# EAGLE design Motor_board (EAGLE 7.1.0)
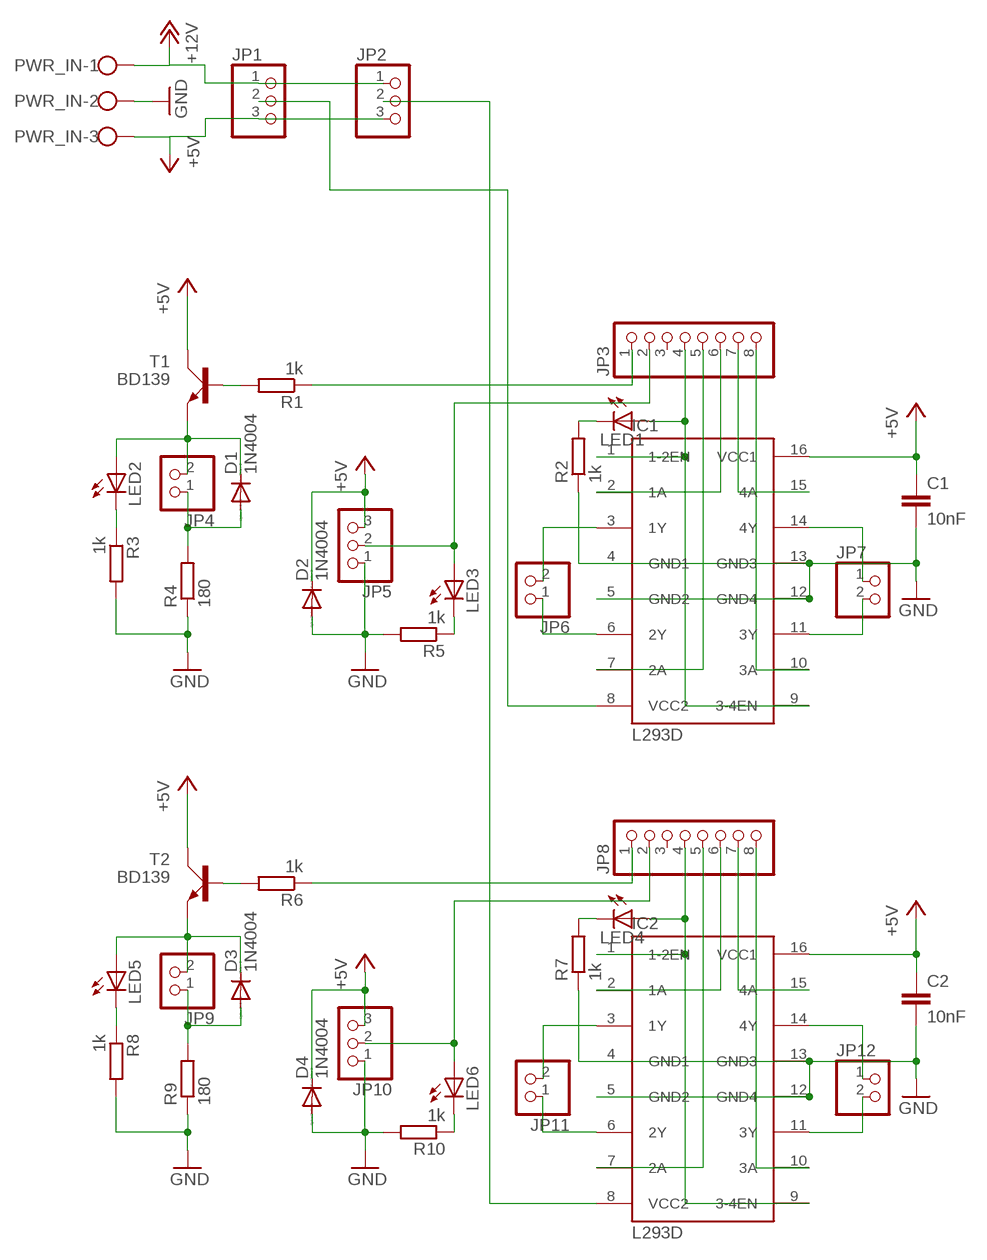
[diagram p0: schematic, sheet 1]

## Parts
C1  10nF  C-EU050-024X044  [C050-024X044]
C2  10nF  C-EU050-024X044  [C050-024X044]
D1  1N4004  [DO41-10]
D2  1N4004  [DO41-10]
D3  1N4004  [DO41-10]
D4  1N4004  [DO41-10]
IC1  L293D  [DIL16]
IC2  L293D  [DIL16]
JP1  PINHD-1X3  [1X03]
JP2  PINHD-1X3  [1X03]
JP3  PINHD-1X8  [1X08]
JP4  PINHD-1X2  [1X02]
JP5  PINHD-1X3  [1X03]
JP6  PINHD-1X2  [1X02]
JP7  PINHD-1X2  [1X02]
JP8  PINHD-1X8  [1X08]
JP9  PINHD-1X2  [1X02]
JP10  PINHD-1X3  [1X03]
JP11  PINHD-1X2  [1X02]
JP12  PINHD-1X2  [1X02]
LED1  LED3MM  [LED3MM]
LED2  LED3MM  [LED3MM]
LED3  LED3MM  [LED3MM]
LED4  LED3MM  [LED3MM]
LED5  LED3MM  [LED3MM]
LED6  LED3MM  [LED3MM]
PWR_IN  W237-103  [W237-103]
R1  1k  R-EU_0207/7  [0207/7]
R2  1k  R-EU_0207/7  [0207/7]
R3  1k  R-EU_0207/7  [0207/7]
R4  180  R-EU_0414/5V  [0414V]
R5  1k  R-EU_0207/7  [0207/7]
R6  1k  R-EU_0207/7  [0207/7]
R7  1k  R-EU_0207/7  [0207/7]
R8  1k  R-EU_0207/7  [0207/7]
R9  180  R-EU_0414/5V  [0414V]
R10  1k  R-EU_0207/7  [0207/7]
T1  BD139  [TO126AV]
T2  BD139  [TO126AV]

## Nets
+5V [power]: C1.1 C2.1 D2.C D4.C IC1.16(VCC1) IC2.16(VCC1) JP1.3 JP2.3 JP5.3 JP10.3 PWR_IN.3 T1.C T2.C
+12V [power]: JP1.1 JP2.1 PWR_IN.1
GND: C1.2 C2.2 D2.A D4.A IC1.4(GND1) IC1.5(GND2) IC1.12(GND4) IC1.13(GND3) IC2.4(GND1) IC2.5(GND2) IC2.12(GND4) IC2.13(GND3) JP5.1 JP10.1 PWR_IN.2 R2.1 R3.2 R4.1 R5.2 R7.1 R8.2 R9.1 R10.2
MTR_PWR1 [power]: IC1.8(VCC2) JP1.2
MTR_PWR2 [power]: IC2.8(VCC2) JP2.2
N$1: IC2.1(1-2EN) IC2.9(3-4EN) JP8.4 LED4.A
N$2: IC2.2(1A) JP8.6
N$3: IC2.7(2A) JP8.5
N$4: IC2.3(1Y) JP11.2
N$5: IC2.6(2Y) JP11.1
N$6: IC2.11(3Y) JP12.2
N$7: IC1.1(1-2EN) IC1.9(3-4EN) JP3.4 LED1.A
N$8: IC1.10(3A) JP3.8
N$9: IC2.14(4Y) JP12.1
N$10: IC1.2(1A) JP3.6
N$11: IC1.7(2A) JP3.5
N$12: IC1.15(4A) JP3.7
N$13: IC2.10(3A) JP8.8
N$14: IC1.3(1Y) JP6.2
N$15: IC1.6(2Y) JP6.1
N$16: IC1.11(3Y) JP7.2
N$17: IC1.14(4Y) JP7.1
N$18: IC2.15(4A) JP8.7
N$19: R6.2 T2.B
N$20: JP8.1 R6.1
N$21: JP8.2 JP10.2 LED6.A
N$22: D3.A JP9.1 R9.2
N$23: LED1.K(C) R2.2
N$24: R1.2 T1.B
N$25: JP3.1 R1.1
N$26: D1.A JP4.1 R4.2
N$27: JP3.2 JP5.2 LED3.A
N$28: D3.C JP9.2 LED5.A T2.E
N$29: LED5.K(C) R8.1
N$30: LED4.K(C) R7.2
N$31: LED6.K(C) R10.1
N$32: D1.C JP4.2 LED2.A T1.E
N$33: LED2.K(C) R3.1
N$35: LED3.K(C) R5.1
Unconnected: JP3.3 JP8.3

## Library data of the parts
C1 C2 = rcl:C-EU: CAPACITOR, European symbol
D1-D4 = diode:1N4004: DIODE general purpose rectifier, 1 A
IC1 IC2 = st-microelectronics:L293D: PUSH-PULL 4 CHANNEL DRIVER; MPN: L293D; OC_FARNELL: 9589619; OC_NEWARK: 56P8249
JP1 JP2 JP5 JP10 = pinhead:PINHD-1X3: PIN HEADER
JP3 JP8 = pinhead:PINHD-1X8: PIN HEADER
JP4 JP6 JP7 JP9 JP11 JP12 = pinhead:PINHD-1X2: PIN HEADER
LED1-LED6 = led:LED: LED OSRAM: - CHIPLED LG R971, LG N971, LY N971, LG Q971, LY Q971, LO R971, LY R971 LH N974, LH R974 LS Q976, LO Q976, LY Q976 LO Q996 - Hyper CHIPLED LW Q18S LB Q993, LB Q99A, LB R99A - SideLED LS A670, LO A670, LY A670, LG A670, LP A670 LB A673, LV A673, LT A673, LW A673 LH A674 LY A675 LS A676, LA A676, LO A676, LY A676, LW A676 LS A679, LY A679, LG A679 - Hyper Micro SIDELED® LS Y876, LA Y876, LO Y876, LY Y876 LT Y87S - SmartLED LW L88C, LW L88S LB L89C, LB L89S, LG L890 LS L89K, LO L89K, LY L89K LS L896, LA L896, LO L896, LY L896 - TOPLED LS T670, LO T670, LY T670, LG T670, LP T670 LSG T670, LSP T670, LSY T670, LOP T670, LYG T670 LG T671, LOG T671, LSG T671 LB T673, LV T673, LT T673, LW T673 LH T674 LS T676, LA T676, LO T676, LY T676, LB T676, LH T676, LSB T676, LW T676 LB T67C, LV T67C, LT T67C, LS T67K, LO T67K, LY T67K, LW E67C LS E67B, LA E67B, LO E67B, LY E67B, LB E67C, LV E67C, LT E67C LW T67C LS T679, LY T679, LG T679 LS T770, LO T770, LY T770, LG T770, LP T770 LB T773, LV T773, LT T773, LW T773 LH T774 LS E675, LA E675, LY E675, LS T675 LS T776, LA T776, LO T776, LY T776, LB T776 LHGB T686 LT T68C, LB T68C - Hyper Mini TOPLED® LB M676 - Mini TOPLED Santana® LG M470 LS M47K, LO M47K, LY M47K Source: http://www.osram.convergy.de LUXEON: - LUMILED® LXK2-PW12-R00, LXK2-PW12-S00, LXK2-PW14-U00, LXK2-PW14-V00 LXK2-PM12-R00, LXK2-PM12-S00, LXK2-PM14-U00 LXK2-PE12-Q00, LXK2-PE12-R00, LXK2-PE12-S00, LXK2-PE14-T00, LXK2-PE14-U00 LXK2-PB12-K00, LXK2-PB12-L00, LXK2-PB12-M00, LXK2-PB14-N00, LXK2-PB14-P00, LXK2-PB14-Q00 LXK2-PR12-L00, LXK2-PR12-M00, LXK2-PR14-Q00, LXK2-PR14-R00 LXK2-PD12-Q00, LXK2-PD12-R00, LXK2-PD12-S00 LXK2-PH12-R00, LXK2-PH12-S00 LXK2-PL12-P00, LXK2-PL12-Q00, LXK2-PL12-R00 Source: www.luxeon.com KINGBRIGHT: KA-3528ASYC Source: www.kingbright.com
PWR_IN = con-wago-500:W237-103: WAGO SCREW CLAMP; MPN: 237-103; OC_FARNELL: unknown; OC_NEWARK: 18M7116
R1-R10 = rcl:R-EU_: RESISTOR, European symbol
T1 T2 = transistor-power:BD139: NPN TRANSISTOR

## Net classes
1 power: width 0.4 mm

## Board
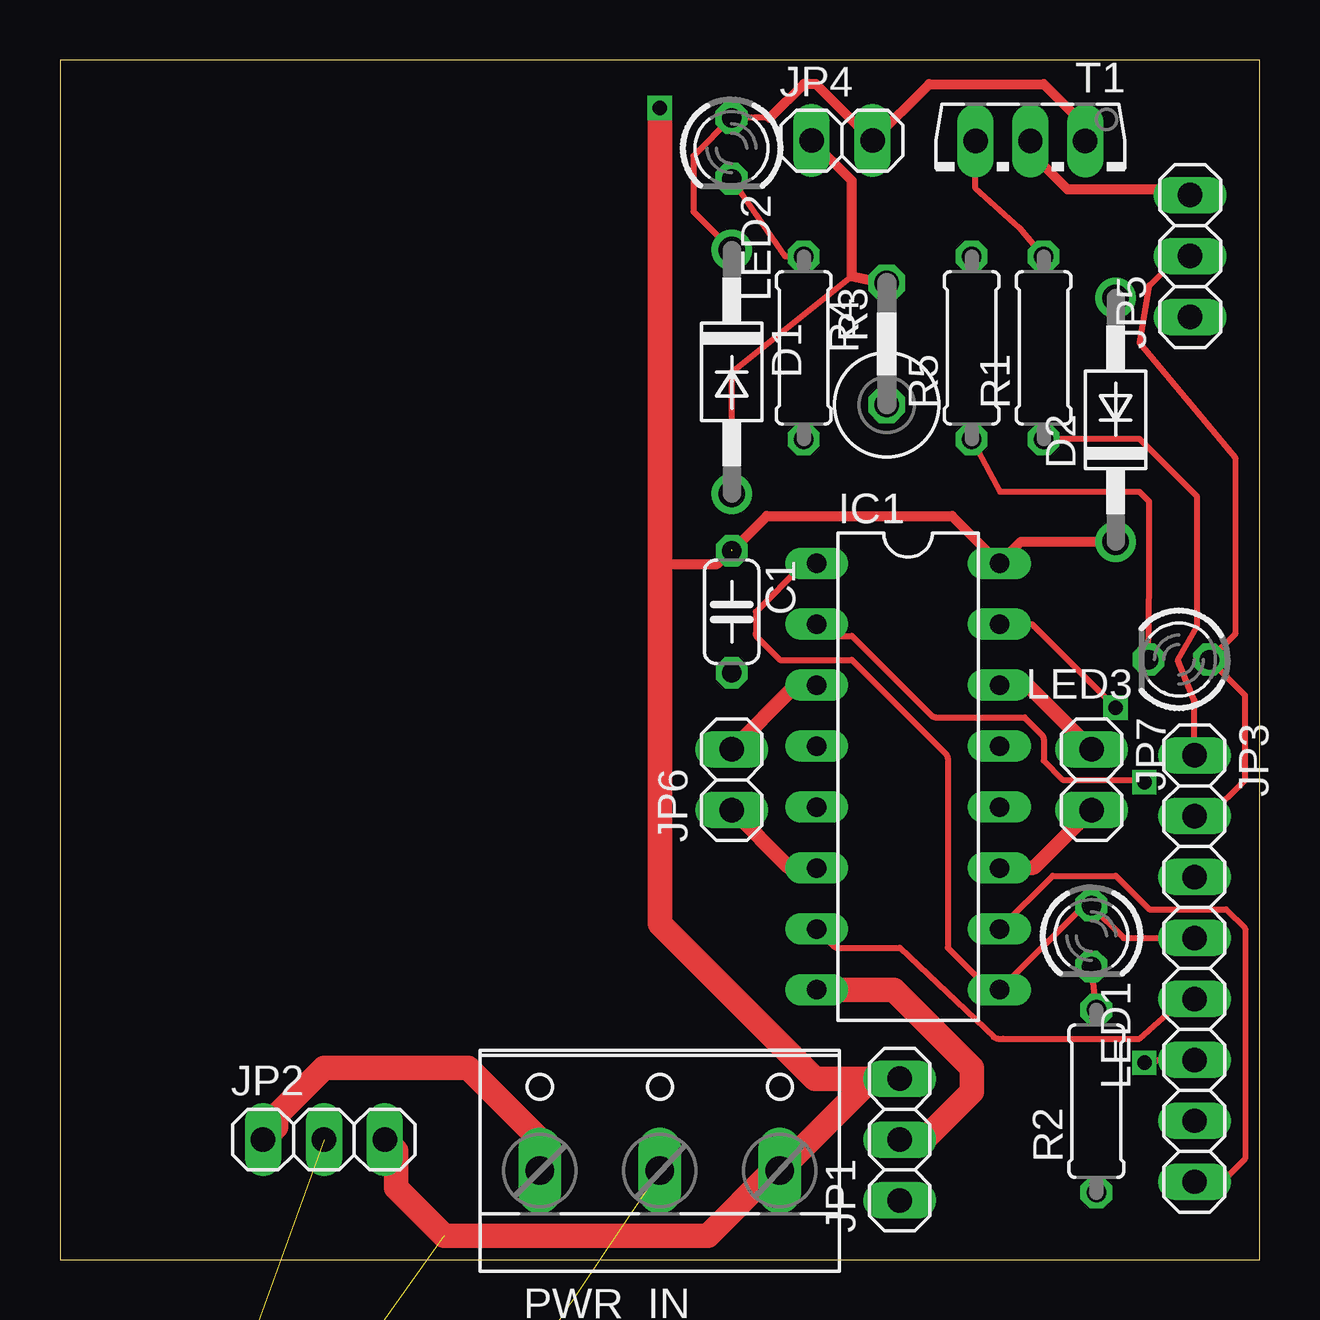
[diagram p1: board, top side]
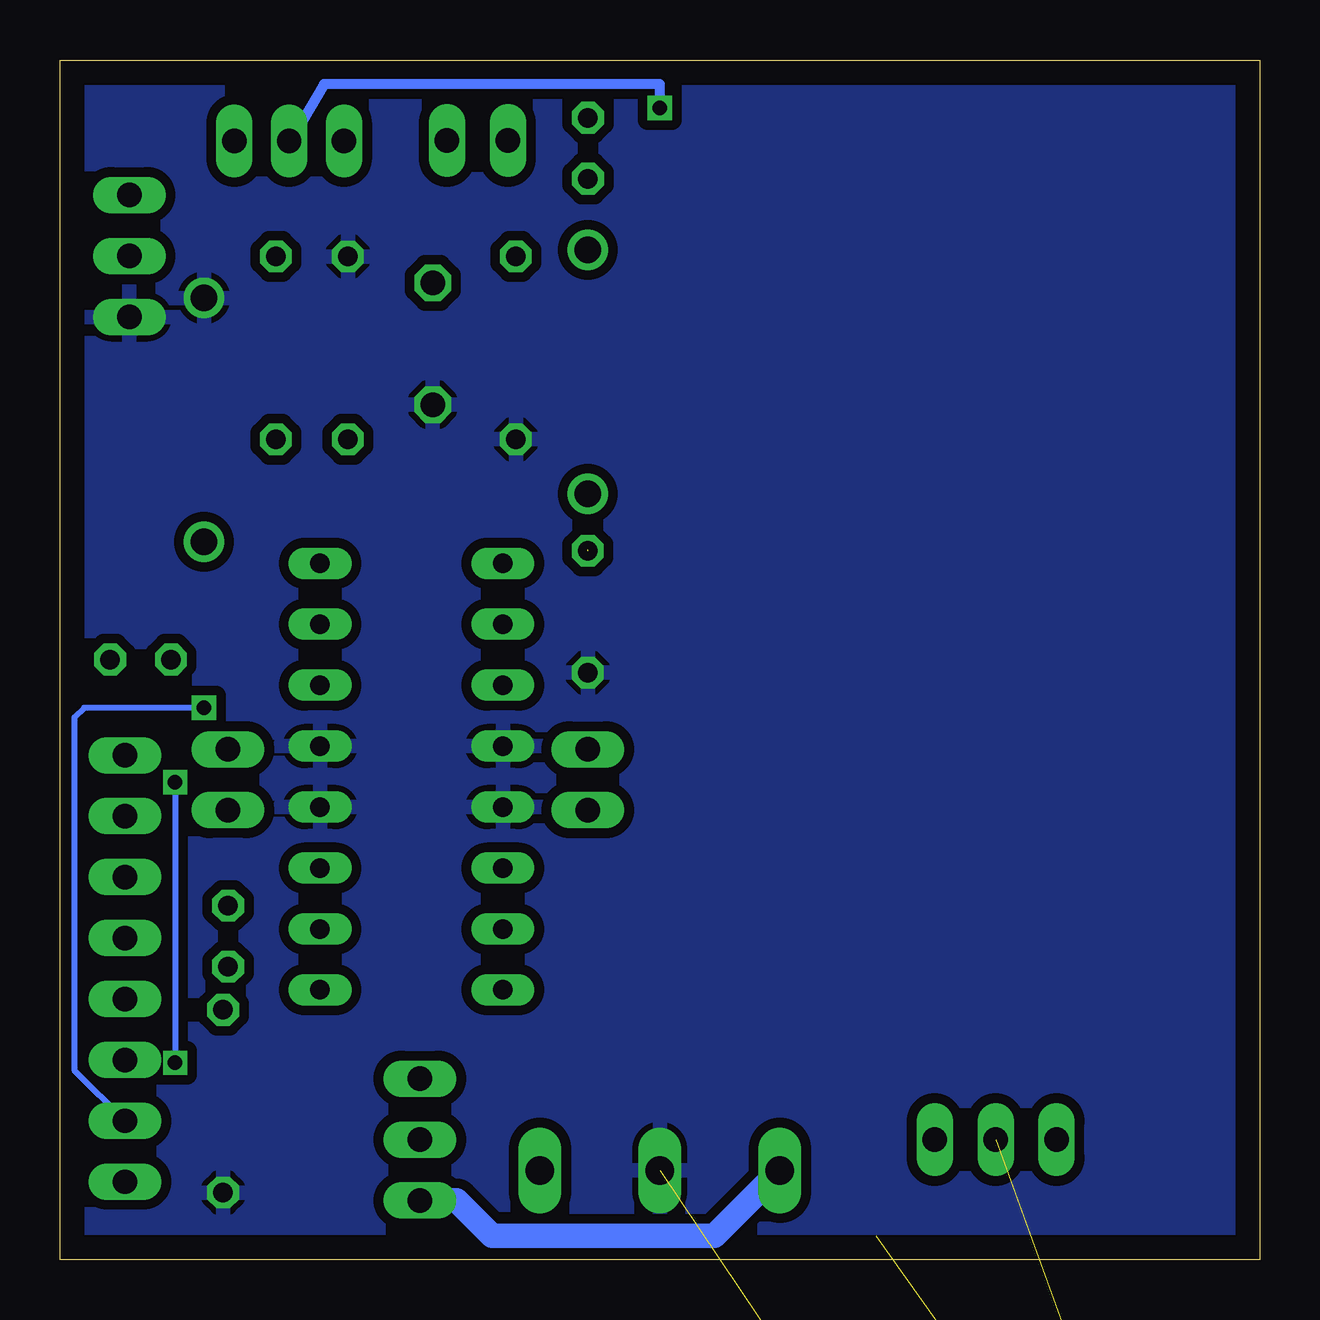
[diagram p2: board, bottom side, seen from below]

Size 50 x 50 mm. Coordinates in mm from the lower left corner, seen from the top.
Outline: 0,0 50,0 50,50 0,50 0,0
Copper layers (1*16): Top 0.035mm / dielectric 1.5mm / Bottom 0.035mm
Design rules "default": minimum track width 10mil, minimum drill 24mil, track to track 8mil, track to pad 8mil, pad to pad 8mil, via to via 8mil, smd to smd 8mil, copper to edge 40mil, drill to drill 8mil, minimum pad ring 10mil, minimum via ring 8mil, stop-mask expansion 4mil, vias tented up to drill 0mil, thermal gap 10mil

### Footprints (pad centres in the part's own frame; a part is rotated, then mirrored left to right if it is on the bottom)
C050-024X044 = drill 0.813 octagon: 1 -2.54,0; 2 2.54,0
DO41-10 = drill 1.118: A 5.08,0; C -5.08,0
DIL16 = drill 0.813 long: 1 -8.89,-3.81; 2 -6.35,-3.81; 3 -3.81,-3.81; 4 -1.27,-3.81; 5 1.27,-3.81; 6 3.81,-3.81; 7 6.35,-3.81; 8 8.89,-3.81; 9 8.89,3.81; 10 6.35,3.81; 11 3.81,3.81; 12 1.27,3.81; 13 -1.27,3.81; 14 -3.81,3.81; 15 -6.35,3.81; 16 -8.89,3.81
1X03 = drill 1.016 long: 1 -2.54,0; 2 0,0; 3 2.54,0
1X08 = drill 1.016 long: 1 -8.89,0; 2 -6.35,0; 3 -3.81,0; 4 -1.27,0; 5 1.27,0; 6 3.81,0; 7 6.35,0; 8 8.89,0
1X02 = drill 1.016 long: 1 -1.27,0; 2 1.27,0
LED3MM = drill 0.813 octagon: A -1.27,0; K 1.27,0
W237-103 = drill 1.194 long: 1 -5,-1.29; 2 0,-1.29; 3 5,-1.29
0207/7 = drill 0.813 octagon: 1 -3.81,0; 2 3.81,0
0414V = drill 1.016 octagon: 1 -2.54,0; 2 2.54,0
TO126AV = drill 1.016 long: B 2.286,-1.27; C 0,-1.27; E -2.286,-1.27

### Placement (x,y rotation side)
C1  28,27 270 top
C2  -13,-89 0 top  (outside the outline)
D1  28,37 270 top
D2  44,35 90 top
D3  -36,-90 0 top  (outside the outline)
D4  -23,-90 0 top  (outside the outline)
IC1  35.35,20.13 270 top
IC2  -30,-80 0 top  (outside the outline)
JP1  35,5 90 top
JP2  11,5 0 top
JP3  47.29,12.13 270 top
JP4  32.6,46.64 0 top
JP5  47.11,41.83 90 top
JP6  28,20 90 top
JP7  43,20 270 top
JP8  -23,-97 0 top  (outside the outline)
JP9  -18,-104 0 top  (outside the outline)
JP10  -38,-104 0 top  (outside the outline)
JP11  -30,-104 0 top  (outside the outline)
JP12  -24,-104 0 top  (outside the outline)
LED1  42.99,13.48 270 top
LED2  27.99,46.32 270 top
LED3  46.64,25.01 180 top
LED4  -18,-109 0 top  (outside the outline)
LED5  -28,-109 0 top  (outside the outline)
LED6  -40,-114 0 top  (outside the outline)
PWR_IN  25,5 0 top
R1  41,38 90 top
R2  43.2,6.6 90 top
R3  31,38 270 top
R4  34.46,38.17 90 top
R5  38,38 90 top
R6  -28,-115 0 top  (outside the outline)
R7  -38,-120 0 top  (outside the outline)
R8  -18,-115 0 top  (outside the outline)
R9  -38,-97 0 top  (outside the outline)
R10  -28,-120 0 top  (outside the outline)
T1  40.45,45.36 180 top
T2  -40,-109 0 top  (outside the outline)

### Tracks (layer width: path | path; a pad name or v marks a point on that pad's centre or on a via)
+5V  (via drill 0.6)  (6 unrouted)
  Top 0.406: JP5.3 46.28,44.6 42,44.6 40.45,46.15 T1.C | D2.C 40.06,29.92 IC1.16 37.18,31 29.46,31 C1.1 | 25,29 27.4,29 28,29.6
  Top 1.016: JP2.3 14,4.54 14,3 16,1 27,1 29.71,3.71 PWR_IN.3 33.83,7.54 JP1.3 31.46,7.54 25,14 25,29 v25,48
  Bottom 0.406: v25,48 25,49 39,49 40.4,46.6 40.43,46.63 T1.C
+12V
  Top 1.016: PWR_IN.1 20,5 17,8 11,8 9,6 9,5.54 JP2.1
  Bottom 1.016: JP1.1 33.46,2.46 32,1 22.71,1 PWR_IN.1
GND  (11 unrouted)
  pour Bottom (isolate 0.406): 1,49 1,1 49,1 49,49
MTR_PWR1
  Top 1.016: IC1.8 34.76,11.24 38,8 38,7 36,5 JP1.2
MTR_PWR2  (1 unrouted)
N$1  (3 unrouted)
N$2  (1 unrouted)
N$3  (1 unrouted)
N$4  (1 unrouted)
N$5  (1 unrouted)
N$6  (1 unrouted)
N$7
  Top 0.254: IC1.1 31.12,29.02 arc45 30.95,28.95 29,27 29,26.11 arc45 29.07,25.93 30,25 33,25 36.93,21.07 arc-45 37,20.89 37,13 38.69,11.31 arc45 38.87,11.24 IC1.9 42.67,14.75 LED1.A 44.34,13.4 JP3.4
N$8
  Top 0.254: IC1.10 41.38,16 44,16 45.4,14.6 48.6,14.6 49.4,13.8 49.4,4.2 48.44,3.24 JP3.8
N$9  (1 unrouted)
N$10  (via drill 0.6)
  Top 0.254: IC1.2 31.95,26.07 arc45 32.12,26 33,26 36.33,22.67 arc45 36.51,22.6 40.2,22.6 40.93,21.87 arc-45 41,21.7 41,20.8 41.8,20 45.09,20 v45.2,19.89 | v45.2,8.2 45.65,8.25 arc-45 45.83,8.32 JP3.6
  Bottom 0.254: v45.2,19.89 v45.2,8.2
N$11
  Top 0.254: IC1.7 32.25,13.07 arc45 32.42,13 35,13 38.93,9.27 arc45 39.3,9.2 45,9.2 46.79,10.79 arc-45 46.97,10.86 JP3.5
N$12  (via drill 0.6)
  Top 0.254: IC1.15 40.52,26.48 v44,23
  Bottom 0.254: v44,23 49,23 49.4,22.6 49.4,7.89 JP3.7
N$13  (1 unrouted)
N$14
  Top 0.61: IC1.3 30.8,23.94 arc45 30.58,23.85 JP6.2
N$15
  Top 0.61: IC1.6 30.54,16.32 arc-45 30.32,16.41 JP6.1
N$16
  Top 0.61: IC1.11 40.46,16.32 arc45 40.68,16.41 JP7.2
N$17
  Top 0.61: IC1.14 40.2,23.94 arc-45 40.42,23.85 JP7.1
N$18  (1 unrouted)
N$19  (1 unrouted)
N$20  (1 unrouted)
N$21  (2 unrouted)
N$22  (2 unrouted)
N$23
  Top 0.254: R2.2 43.06,11.55 arc-45 42.99,11.72 LED1.K
N$24
  Top 0.254: R1.2 40,43 38.16,44.65 T1.B
N$25
  Top 0.254: JP3.1 47.29,23.31 46.6,25 47.4,26.4 47.4,31.8 45,34.2 42.01,34.2 R1.1
N$26
  Top 0.254: D1.A 28,37 33,41 | 34.29,40.71 R4.2
  Top 0.406: JP4.1 33,44.97 33,41 34.29,40.71
N$27
  Top 0.254: JP3.2 47.88,18.48 49.4,20 49.4,23.52 LED3.A 49,26.1 49,33.4 45,38.2 45.4,40.6 46.43,41.63 JP5.2
N$28  (3 unrouted)
N$29  (1 unrouted)
N$30  (1 unrouted)
N$31  (1 unrouted)
N$32
  Top 0.254: 42.74,47.26 T1.E | 29.59,47.59 LED2.A 26.4,46 26.4,43.68 D1.C
  Top 0.406: 42.74,47.26 41,49 36.23,49 JP4.2 31.51,49 31,49 29.59,47.59
N$33
  Top 0.254: R3.1 30.23,41.81 LED2.K
N$35
  Top 0.254: LED3.K 45.4,28.38 45.4,31.6 45,32 39.19,32 R5.1